# Altium project CM4.PrjPcb
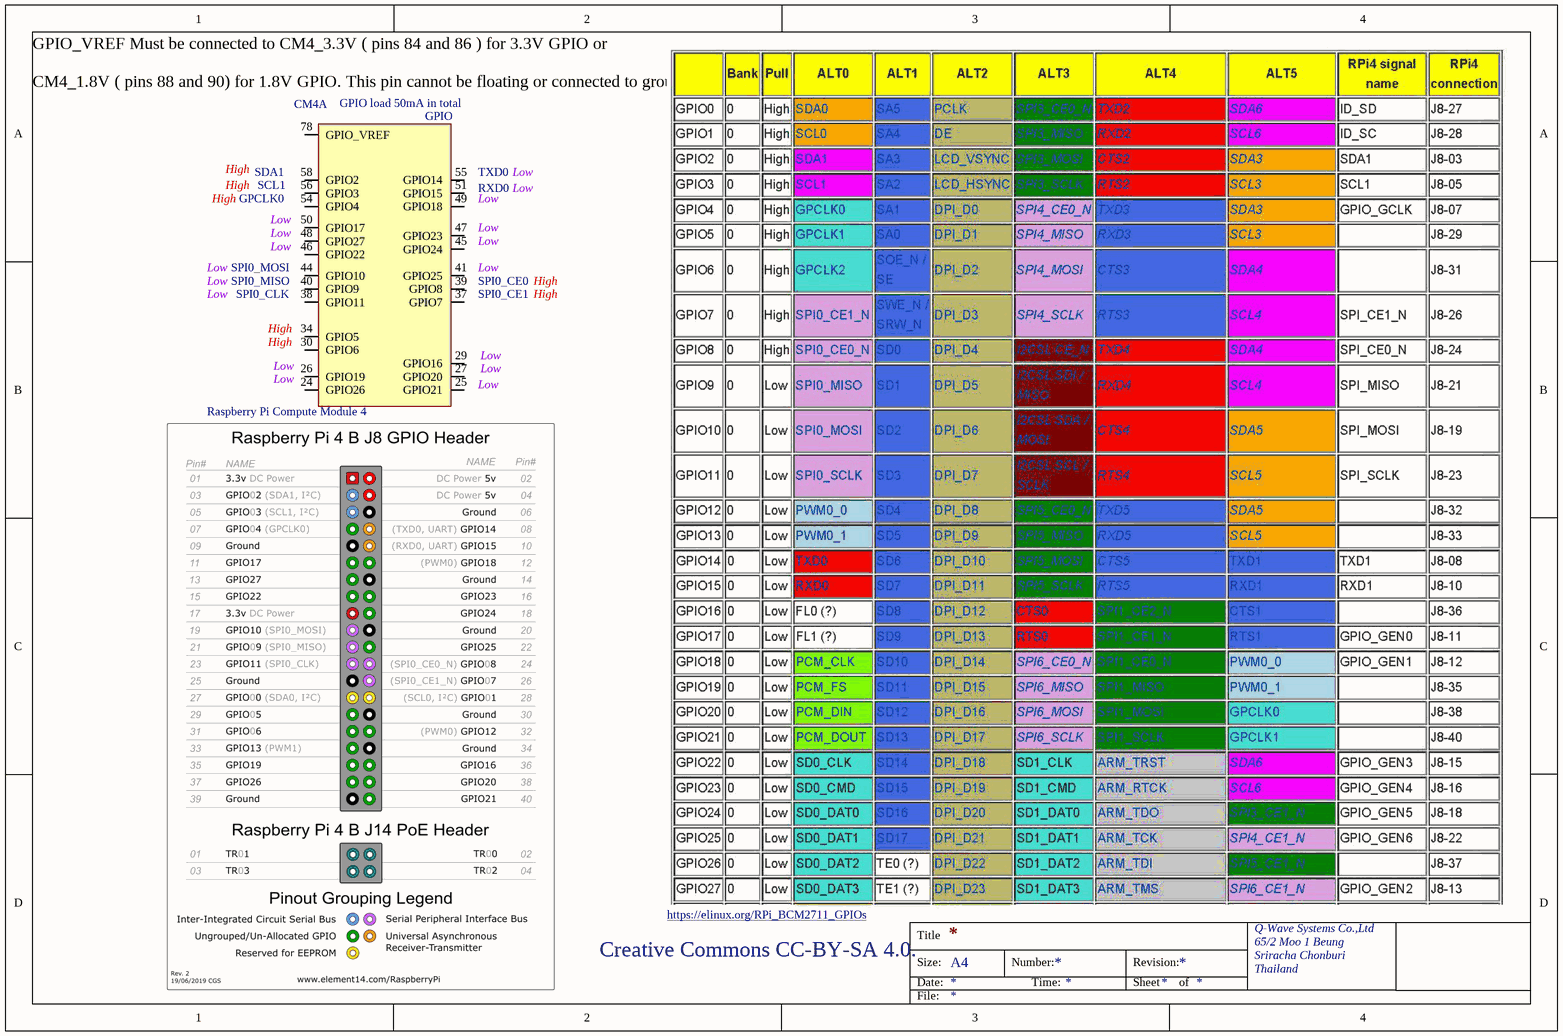
[diagram p0: GPIO.SchDoc]
2 sheets, 1 parts. Net scope: global (net labels, ports and power ports of the same name join across sheets).
Board file: CM4-Main.PcbDoc
Sheets:
  GPIO.SchDoc
  Power.SchDoc

## Sheet GPIO.SchDoc
size A4

### Parts
CM4  Raspberry Pi Compute Module 4  [CM4-F40C-100DS-0.4v_1.5mm_0mm]  (part A of 21)

### Nets

Not connected (* = marked no-connect by the designer): CM4 24(GPIO26) 25(GPIO21) 26(GPIO19) 27(GPIO20) 29(GPIO16) 30(GPIO6) 34(GPIO5) 37(GPIO7) 38(GPIO11) 39(GPIO8) 40(GPIO9) 41(GPIO25) 44(GPIO10) 45(GPIO24) 46(GPIO22) 47(GPIO23) 48(GPIO27) 49(GPIO18) 50(GPIO17) 51(GPIO15) 54(GPIO4) 55(GPIO14) 56(GPIO3) 58(GPIO2) 78(GPIO_VREF)

### Notes on the sheet
- (near CM4) GPIO_VREF Must be connected to CM4_3.3V ( pins 84 and 86 ) for 3.3V GPIO or
  CM4_1.8V ( pins 88 and 90) for 1.8V GPIO. This pin cannot be floating or connected to ground
- https://elinux.org/RPi_BCM2711_GPIOs
- Creative Commons CC-BY-SA 4.0.
- Title
- Size:
- Date:
- A4
- Number:
- Time:
- Revision:
- Sheet
- of
- Q-Wave Systems Co.,Ltd
- 65/2 Moo 1 Beung
- Sriracha Chonburi
- Thailand
- File:
- (in symbol CM4, part A) GPIO load 50mA in total; GPIO; High; SDA1; TXD0; Low; SCL1; RXD0; GPCLK0; SPI0_MOSI; SPI0_MISO; SPI0_CE0; SPI0_CLK; SPI0_CE1; by Amornthep Phunsin

### Library data of the parts
CM4 = CM4: Raspberry Pi Compute Module 4 by Amornthep Phunsin

## Sheet Power.SchDoc
size A4
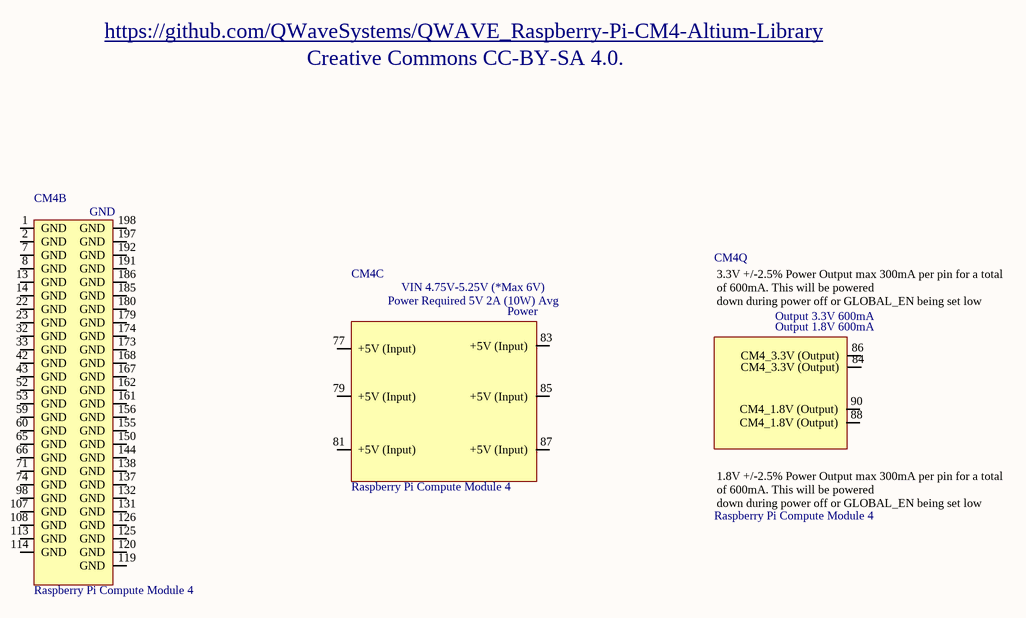
[diagram p1: Power.SchDoc]

### Parts
CM4  Raspberry Pi Compute Module 4  [CM4-F40C-100DS-0.4v_1.5mm_0mm]  (parts B,C,Q of 21)

### Nets

Not connected (* = marked no-connect by the designer): CM4 1(GND) 2(GND) 7(GND) 8(GND) 13(GND) 14(GND) 22(GND) 23(GND) 32(GND) 33(GND) 42(GND) 43(GND) 52(GND) 53(GND) 59(GND) 60(GND) 65(GND) 66(GND) 71(GND) 74(GND) 77(+5V_(Input)) 79(+5V_(Input)) 81(+5V_(Input)) 83(+5V_(Input)) 84(CM4_3.3V_(Output)) 85(+5V_(Input)) 86(CM4_3.3V_(Output)) 87(+5V_(Input)) 88(CM4_1.8V_(Output)) 90(CM4_1.8V_(Output)) 98(GND) 107(GND) 108(GND) 113(GND) 114(GND) 119(GND) 120(GND) 125(GND) 126(GND) 131(GND) 132(GND) 137(GND) 138(GND) 144(GND) 150(GND) 155(GND) 156(GND) 161(GND) 162(GND) 167(GND) 168(GND) 173(GND) 174(GND) 179(GND) 180(GND) 185(GND) 186(GND) 191(GND) 192(GND) 197(GND) 198(GND)

### Notes on the sheet
- https://github.com/QWaveSystems/QWAVE_Raspberry-Pi-CM4-Altium-Library
- Creative Commons CC-BY-SA 4.0.
- Title
- Size:
- Date:
- A4
- Number:
- Time:
- Revision:
- Sheet
- of
- Q-Wave Systems Co.,Ltd
- 65/2 Moo 1 Beung
- Sriracha Chonburi
- Thailand
- File:
- (in symbol CM4, part C) VIN 4.75V-5.25V (*Max 6V); Power Required 5V 2A (10W) Avg; Power
- (in symbol CM4, part Q) 3.3V +/-2.5% Power Output max 300mA per pin for a total of 600mA. This will be powered / down during power off or GLOBAL_EN being set low; Output 3.3V 600mA; Output 1.8V 600mA; 1.8V +/-2.5% Power Output max 300mA per pin for a total of 600mA. This will be powered / down during power off or GLOBAL_EN being set low

### Library data of the parts
CM4 = CM4